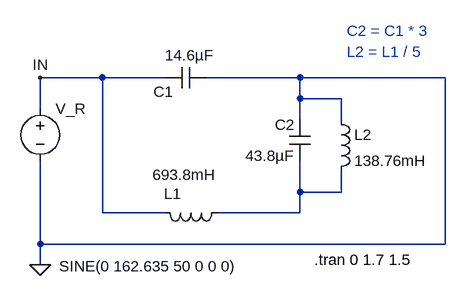
[diagram p0: schematic KondensatorOben3_5.asc]
KondensatorOben3_5.asc, the LTspice schematic file:
Version 4
SHEET 1 2464 1756
WIRE -240 608 -384 608
WIRE -640 864 -640 736
WIRE -640 864 -640 896
WIRE -640 656 -640 608
WIRE -640 608 -544 608
WIRE -16 608 -16 864
WIRE -16 608 -240 608
WIRE -544 608 -544 816
WIRE -544 608 -448 608
WIRE -544 816 -448 816
WIRE -240 816 -240 784
WIRE -368 816 -240 816
WIRE -240 640 -240 608
WIRE -16 864 -640 864
WIRE -176 640 -176 672
WIRE -240 784 -240 736
WIRE -240 640 -176 640
WIRE -176 784 -240 784
WIRE -240 672 -240 640
WIRE -176 752 -176 784
FLAG -640 608 IN
FLAG -640 896 0
SYMBOL VOLTAGE -640 640 R0
WINDOW 3 29 258 Left 0
SYMATTR Value SINE(0 162.635 50 0 0 0)
SYMATTR Value2 AC 162.635 0
SYMATTR SpiceLine Rser=1m
SYMATTR InstName V_R
SYMBOL cap -384 592 R90
WINDOW 0 53 66 VBottom 0
WINDOW 3 -34 26 VTop 0
SYMATTR InstName C1
SYMATTR Value 14.6µF
SYMATTR SpiceLine V=400 Irms=1 Rser=10m Rpar=1E6
SYMBOL ind -352 800 R90
WINDOW 0 2 84 VBottom 0
WINDOW 3 -58 66 VTop 0
SYMATTR InstName L1
SYMATTR Value 693.8mH
SYMATTR SpiceLine Ipk=2 Rser=2 Rpar=70E3 Cpar=470p
SYMBOL cap -224 672 M0
SYMATTR InstName C2
SYMATTR Value 43.8µF
SYMATTR SpiceLine V=400 Irms=1 Rser=10m Rpar=1E6
SYMBOL ind -192 656 R0
SYMATTR InstName L2
SYMATTR Value 138.76mH
SYMATTR SpiceLine Ipk=2 Rser=0.5 Rpar=70E3 Cpar=470p
TEXT -168 536 Left 0 ;C2 = C1 * 3
TEXT -168 568 Left 0 ;L2 = L1 / 5
TEXT -218 888 Left 0 !.tran 0 1.7 1.5

The netlist it stands for:
* KondensatorOben3_5.asc
V_R IN 0 SINE(0 162.635 50 0 0 0) AC 162.635 0 Rser=1m
C1 0 IN 14.6µF V=400 Irms=1 Rser=10m Rpar=1E6
L1 N001 IN 693.8mH Ipk=2 Rser=2 Rpar=70E3 Cpar=470p
C2 0 N001 43.8µF V=400 Irms=1 Rser=10m Rpar=1E6
L2 0 N001 138.76mH Ipk=2 Rser=0.5 Rpar=70E3 Cpar=470p
* C2 = C1 * 3
* L2 = L1 / 5
.tran 0 1.7 1.5
.backanno
.end